# Altium project Vending machine.PrjPcb
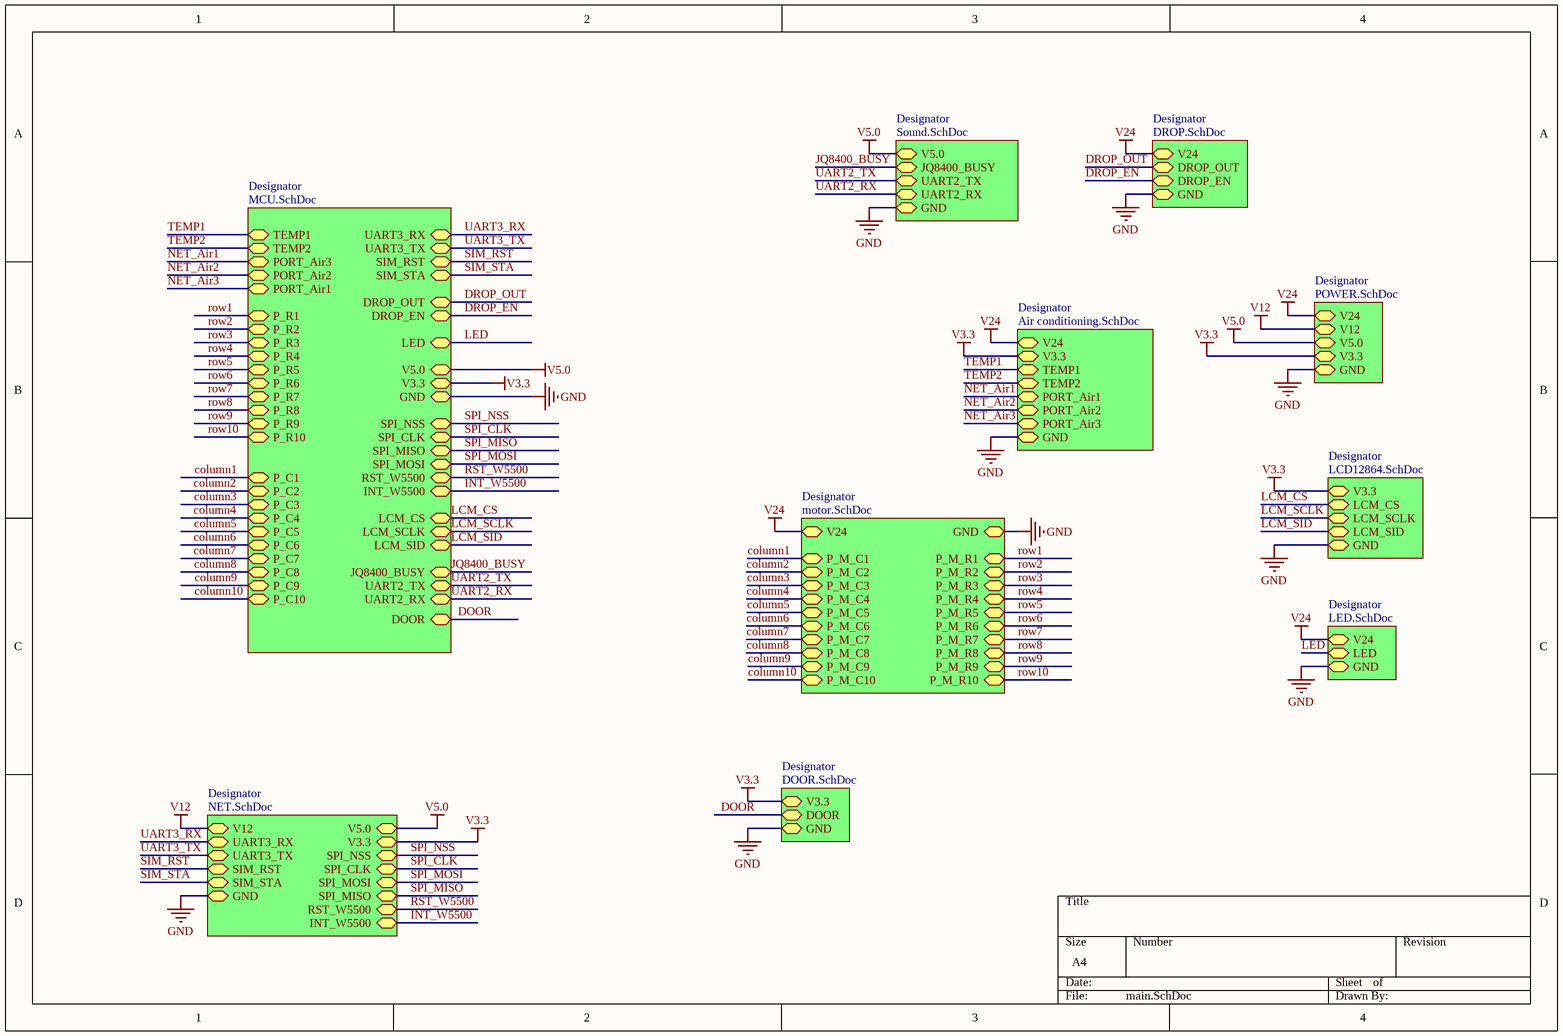
[diagram p0: main.SchDoc]
16 sheets, 316 parts. Net scope: hierarchical (ports join the sheet entries above them; power ports are global).
Board file: PCB.PcbDoc
Sheets:
  main.SchDoc
    Designator = NET.SchDoc
    Designator = motor.SchDoc
      C1 = PULL.SchDoc
      C2 = PULL.SchDoc
      C3 = PULL.SchDoc
      C4 = PULL.SchDoc
      C5 = PULL.SchDoc
      C6 = PULL.SchDoc
      C7 = PULL.SchDoc
      C8 = PULL.SchDoc
      C9 = PULL.SchDoc
      C10 = PULL.SchDoc
      R1 = PUSH.SchDoc
      R2 = PUSH.SchDoc
      R3 = PUSH.SchDoc
      R4 = PUSH.SchDoc
      R5 = PUSH.SchDoc
      R6 = PUSH.SchDoc
      R7 = PUSH.SchDoc
      R8 = PUSH.SchDoc
      R9 = PUSH.SchDoc
      R10 = PUSH.SchDoc
    Designator = Air conditioning.SchDoc
      C11 = PULL.SchDoc
      C12 = PULL.SchDoc
      C13 = PULL.SchDoc
    Designator = DROP.SchDoc
    Designator = LED.SchDoc
    Designator = MCU.SchDoc
      Designator = UART1.SchDoc
      Designator = M24C02.SchDoc
      Designator = RS485.SchDoc
    Designator = POWER.SchDoc
    Designator = Sound.SchDoc
    Designator = LCD12864.SchDoc
    Designator = DOOR.SchDoc

## Sheet main.SchDoc
size A4

### Sub-sheets
Designator = NET.SchDoc: UART3_RX, GND, UART3_TX, V12, SIM_RST, SIM_STA, V5.0, SPI_CLK, SPI_NSS, SPI_MOSI, RST_W5500, SPI_MISO, V3.3, INT_W5500
Designator = motor.SchDoc: V24, GND, P_M_R1, P_M_R3, P_M_R9, P_M_R5, P_M_R6, P_M_R8, P_M_R7, P_M_R10, P_M_R4, P_M_R2, P_M_C6, P_M_C1, P_M_C5, P_M_C9, P_M_C2, P_M_C4, P_M_C3, P_M_C7, P_M_C8, P_M_C10
Designator = Air conditioning.SchDoc: GND, V24, TEMP1, V3.3, TEMP2, PORT_Air2, PORT_Air1, PORT_Air3
Designator = DROP.SchDoc: DROP_EN, V24, GND, DROP_OUT
Designator = LED.SchDoc: LED, V24, GND
Designator = MCU.SchDoc: V5.0, GND, V3.3, TEMP1, TEMP2, DROP_EN, DROP_OUT, JQ8400_BUSY, UART2_RX, UART2_TX, SIM_RST, SIM_STA, UART3_RX, UART3_TX, LED, LCM_SID, LCM_SCLK, LCM_CS, SPI_NSS, SPI_MISO, RST_W5500, SPI_MOSI, INT_W5500, SPI_CLK, PORT_Air3, PORT_Air2, PORT_Air1, P_R4, P_R5, P_R6, P_R7, P_R8, P_R9, P_R10, P_R1, P_R2, P_R3, P_C1, P_C2, P_C3, P_C4, P_C5, P_C6, P_C7, P_C8, P_C9, P_C10, DOOR
Designator = POWER.SchDoc: V5.0, V3.3, GND, V24, V12
Designator = Sound.SchDoc: JQ8400_BUSY, UART2_TX, UART2_RX, GND, V5.0
Designator = LCD12864.SchDoc: LCM_CS, LCM_SCLK, GND, LCM_SID, V3.3
Designator = DOOR.SchDoc: V3.3, DOOR, GND

### Nets
GND: sheet Designator/GND, sheet Designator/GND, sheet Designator/GND, sheet Designator/GND, sheet Designator/GND, sheet Designator/GND, sheet Designator/GND, sheet Designator/GND, sheet Designator/GND, sheet Designator/GND
V3.3: sheet Designator/V3.3, sheet Designator/V3.3, sheet Designator/V3.3, sheet Designator/V3.3, sheet Designator/V3.3, sheet Designator/V3.3
V5.0: sheet Designator/V5.0, sheet Designator/V5.0, sheet Designator/V5.0, sheet Designator/V5.0
V12: sheet Designator/V12, sheet Designator/V12
V24: sheet Designator/V24, sheet Designator/V24, sheet Designator/V24, sheet Designator/V24, sheet Designator/V24
column1: sheet Designator/P_M_C1, sheet Designator/P_C1
column2: sheet Designator/P_M_C2, sheet Designator/P_C2
column3: sheet Designator/P_M_C3, sheet Designator/P_C3
column4: sheet Designator/P_M_C4, sheet Designator/P_C4
column5: sheet Designator/P_M_C5, sheet Designator/P_C5
column6: sheet Designator/P_M_C6, sheet Designator/P_C6
column7: sheet Designator/P_M_C7, sheet Designator/P_C7
column8: sheet Designator/P_M_C8, sheet Designator/P_C8
column9: sheet Designator/P_M_C9, sheet Designator/P_C9
column10: sheet Designator/P_M_C10, sheet Designator/P_C10
DOOR: sheet Designator/DOOR, sheet Designator/DOOR
DROP_EN: sheet Designator/DROP_EN, sheet Designator/DROP_EN
DROP_OUT: sheet Designator/DROP_OUT, sheet Designator/DROP_OUT
INT_W5500: sheet Designator/INT_W5500, sheet Designator/INT_W5500
JQ8400_BUSY: sheet Designator/JQ8400_BUSY, sheet Designator/JQ8400_BUSY
LCM_CS: sheet Designator/LCM_CS, sheet Designator/LCM_CS
LCM_SCLK: sheet Designator/LCM_SCLK, sheet Designator/LCM_SCLK
LCM_SID: sheet Designator/LCM_SID, sheet Designator/LCM_SID
LED: sheet Designator/LED, sheet Designator/LED
NET_Air1: sheet Designator/PORT_Air1, sheet Designator/PORT_Air3  [project net COLUMN11]
NET_Air2: sheet Designator/PORT_Air2, sheet Designator/PORT_Air2  [project net COLUMN12]
NET_Air3: sheet Designator/PORT_Air3, sheet Designator/PORT_Air1  [project net COLUMN13]
row1: sheet Designator/P_M_R1, sheet Designator/P_R1  [project net N_R1]
row2: sheet Designator/P_M_R2, sheet Designator/P_R2  [project net N_R2]
row3: sheet Designator/P_M_R3, sheet Designator/P_R3  [project net N_R3]
row4: sheet Designator/P_M_R4, sheet Designator/P_R4  [project net N_R4]
row5: sheet Designator/P_M_R5, sheet Designator/P_R5  [project net N_R5]
row6: sheet Designator/P_M_R6, sheet Designator/P_R6  [project net N_R6]
row7: sheet Designator/P_M_R7, sheet Designator/P_R7  [project net N_R7]
row8: sheet Designator/P_M_R8, sheet Designator/P_R8  [project net N_R8]
row9: sheet Designator/P_M_R9, sheet Designator/P_R9  [project net N_R9]
row10: sheet Designator/P_M_R10, sheet Designator/P_R10  [project net N_R10]
RST_W5500: sheet Designator/RST_W5500, sheet Designator/RST_W5500
SIM_RST: sheet Designator/SIM_RST, sheet Designator/SIM_RST
SIM_STA: sheet Designator/SIM_STA, sheet Designator/SIM_STA
SPI_CLK: sheet Designator/SPI_CLK, sheet Designator/SPI_CLK  [project net SPI1_CLK]
SPI_MISO: sheet Designator/SPI_MISO, sheet Designator/SPI_MISO  [project net SPI1_MISO]
SPI_MOSI: sheet Designator/SPI_MOSI, sheet Designator/SPI_MOSI  [project net SPI1_MOSI]
SPI_NSS: sheet Designator/SPI_NSS, sheet Designator/SPI_NSS  [project net CS_W5500]
TEMP1: sheet Designator/TEMP1, sheet Designator/TEMP1
TEMP2: sheet Designator/TEMP2, sheet Designator/TEMP2
UART2_RX: sheet Designator/UART2_RX, sheet Designator/UART2_RX
UART2_TX: sheet Designator/UART2_TX, sheet Designator/UART2_TX
UART3_RX: sheet Designator/UART3_RX, sheet Designator/UART3_RX
UART3_TX: sheet Designator/UART3_TX, sheet Designator/UART3_TX

## Sheet NET.SchDoc
size A4
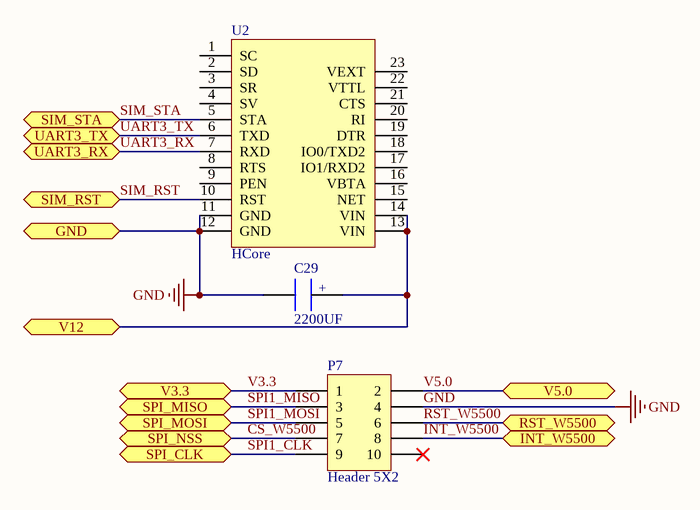
[diagram p1: NET.SchDoc]

### Parts
C29  2200UF  [8X12_CAP]
P7  Header 5X2  [HDR2X5]
U2  HCore  [HCore]

### Ports
GND, INT_W5500, RST_W5500, SIM_RST, SIM_STA, SPI_CLK, SPI_MISO, SPI_MOSI, SPI_NSS, UART3_RX, UART3_TX, V3.3, V5.0, V12

### Nets
GND: C29.2 P7.4 U2.11(GND) U2.12(GND) ; port GND
V3.3: P7.1 ; port V3.3
V5.0: P7.2 ; port V5.0
V12: C29.1 U2.13(VIN) U2.14(VIN) ; port V12
CS_W5500: P7.7 ; port SPI_NSS
INT_W5500: P7.8 ; port INT_W5500
RST_W5500: P7.6 ; port RST_W5500
SIM_RST: U2.10(RST) ; port SIM_RST
SIM_STA: U2.5(STA) ; port SIM_STA
SPI1_CLK: P7.9 ; port SPI_CLK
SPI1_MISO: P7.3 ; port SPI_MISO
SPI1_MOSI: P7.5 ; port SPI_MOSI
UART3_RX: U2.7(RXD) ; port UART3_RX
UART3_TX: U2.6(TXD) ; port UART3_TX

Not connected (* = marked no-connect by the designer): P7 10*; U2 1(SC) 2(SD) 3(SR) 4(SV) 8(RTS) 9(PEN) 15(NET) 16(VBTA) 17(IO1/RXD2) 18(IO0/TXD2) 19(DTR) 20(RI) 21(CTS) 22(VTTL) 23(VEXT)

### Notes on the sheet
- (in symbol CAP) +

### Library data of the parts
C29 = CAP
P7 = Header 5X2: Header, 5-Pin, Dual row; LatestRevisionDate: 17-Jul-2002; LatestRevisionNote: Re-released for DXP Platform.; Publisher: Altium Limited

## Sheet motor.SchDoc
size A4
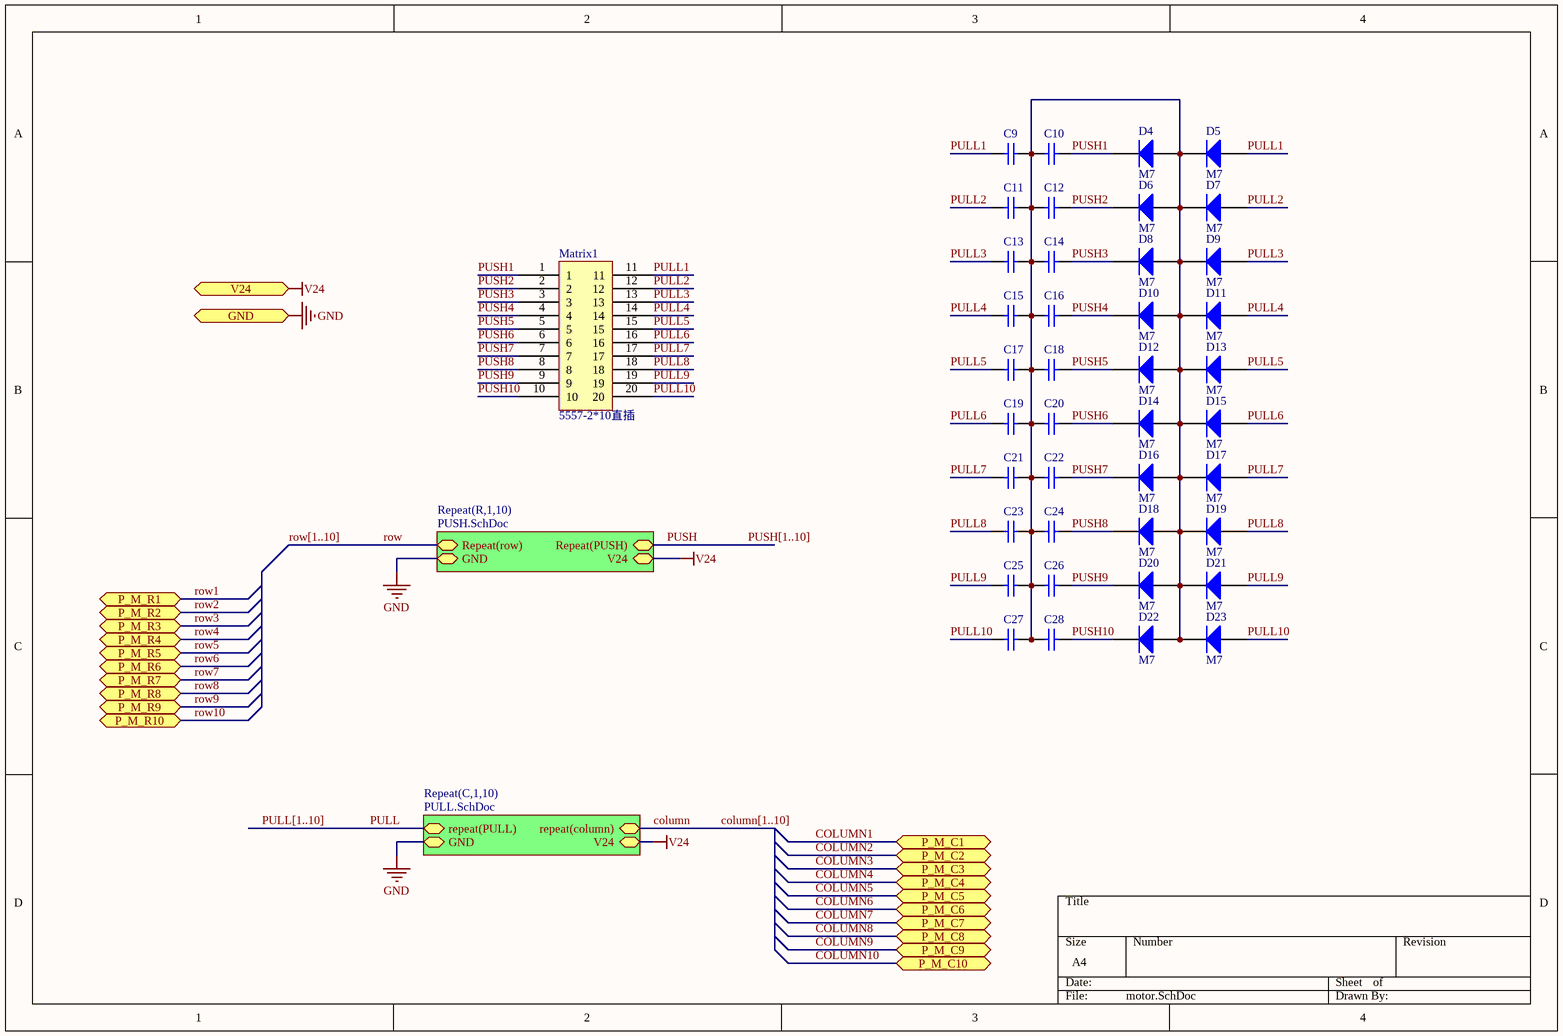
[diagram p2: motor.SchDoc]

### Parts
C9  100nF(104) 10% 50V  [0805_C]  (value not drawn)
C10  100nF(104) 10% 50V  [0805_C]  (value not drawn)
C11  100nF(104) 10% 50V  [0805_C]  (value not drawn)
C12  100nF(104) 10% 50V  [0805_C]  (value not drawn)
C13  100nF(104) 10% 50V  [0805_C]  (value not drawn)
C14  100nF(104) 10% 50V  [0805_C]  (value not drawn)
C15  100nF(104) 10% 50V  [0805_C]  (value not drawn)
C16  100nF(104) 10% 50V  [0805_C]  (value not drawn)
C17  100nF(104) 10% 50V  [0805_C]  (value not drawn)
C18  100nF(104) 10% 50V  [0805_C]  (value not drawn)
C19  100nF(104) 10% 50V  [0805_C]  (value not drawn)
C20  100nF(104) 10% 50V  [0805_C]  (value not drawn)
C21  100nF(104) 10% 50V  [0805_C]  (value not drawn)
C22  100nF(104) 10% 50V  [0805_C]  (value not drawn)
C23  100nF(104) 10% 50V  [0805_C]  (value not drawn)
C24  100nF(104) 10% 50V  [0805_C]  (value not drawn)
C25  100nF(104) 10% 50V  [0805_C]  (value not drawn)
C26  100nF(104) 10% 50V  [0805_C]  (value not drawn)
C27  100nF(104) 10% 50V  [0805_C]  (value not drawn)
C28  100nF(104) 10% 50V  [0805_C]  (value not drawn)
D4  M7  [SMA(DO-214AC)_S1]
D5  M7  [SMA(DO-214AC)_S1]
D6  M7  [SMA(DO-214AC)_S1]
D7  M7  [SMA(DO-214AC)_S1]
D8  M7  [SMA(DO-214AC)_S1]
D9  M7  [SMA(DO-214AC)_S1]
D10  M7  [SMA(DO-214AC)_S1]
D11  M7  [SMA(DO-214AC)_S1]
D12  M7  [SMA(DO-214AC)_S1]
D13  M7  [SMA(DO-214AC)_S1]
D14  M7  [SMA(DO-214AC)_S1]
D15  M7  [SMA(DO-214AC)_S1]
D16  M7  [SMA(DO-214AC)_S1]
D17  M7  [SMA(DO-214AC)_S1]
D18  M7  [SMA(DO-214AC)_S1]
D19  M7  [SMA(DO-214AC)_S1]
D20  M7  [SMA(DO-214AC)_S1]
D21  M7  [SMA(DO-214AC)_S1]
D22  M7  [SMA(DO-214AC)_S1]
D23  M7  [SMA(DO-214AC)_S1]
Matrix1  5557-2*10直插  [5557_2*10]

### Sub-sheets
Repeat(C,1,10) = PULL.SchDoc: repeat(PULL), GND, repeat(column), V24
Repeat(R,1,10) = PUSH.SchDoc: Repeat(PUSH), V24, Repeat(row), GND

### Ports
GND, P_M_C1, P_M_C2, P_M_C3, P_M_C4, P_M_C5, P_M_C6, P_M_C7, P_M_C8, P_M_C9, P_M_C10, P_M_R1, P_M_R2, P_M_R3, P_M_R4, P_M_R5, P_M_R6, P_M_R7, P_M_R8, P_M_R9, P_M_R10, V24

### Nets
GND: port GND, sheet Repeat(C,1,10)/GND, sheet Repeat(R,1,10)/GND
V24: port V24, sheet Repeat(C,1,10)/V24, sheet Repeat(R,1,10)/V24
column: sheet Repeat(C,1,10)/repeat(column)
PULL: sheet Repeat(C,1,10)/repeat(PULL)
PULL1: C9.1 D5.1(A) Matrix1.11
PULL2: C11.1 D7.1(A) Matrix1.12
PULL3: C13.1 D9.1(A) Matrix1.13
PULL4: C15.1 D11.1(A) Matrix1.14
PULL5: C17.1 D13.1(A) Matrix1.15
PULL6: C19.1 D15.1(A) Matrix1.16
PULL7: C21.1 D17.1(A) Matrix1.17
PULL8: C23.1 D19.1(A) Matrix1.18
PULL9: C25.1 D21.1(A) Matrix1.19
PULL10: C27.1 D23.1(A) Matrix1.20
PUSH: sheet Repeat(R,1,10)/Repeat(PUSH)
PUSH1: C10.2 D4.2(K) Matrix1.1
PUSH2: C12.2 D6.2(K) Matrix1.2
PUSH3: C14.2 D8.2(K) Matrix1.3
PUSH4: C16.2 D10.2(K) Matrix1.4
PUSH5: C18.2 D12.2(K) Matrix1.5
PUSH6: C20.2 D14.2(K) Matrix1.6
PUSH7: C22.2 D16.2(K) Matrix1.7
PUSH8: C24.2 D18.2(K) Matrix1.8
PUSH9: C26.2 D20.2(K) Matrix1.9
PUSH10: C28.2 D22.2(K) Matrix1.10
row: sheet Repeat(R,1,10)/Repeat(row)
NetC9_2: C9.2 C10.1 C11.2 C12.1 C13.2 C14.1 C15.2 C16.1 C17.2 C18.1 C19.2 C20.1 C21.2 C22.1 C23.2 C24.1 C25.2 C26.1 C27.2 C28.1 D4.1(A) D5.2(K) D6.1(A) D7.2(K) D8.1(A) D9.2(K) D10.1(A) D11.2(K) D12.1(A) D13.2(K) D14.1(A) D15.2(K) D16.1(A) D17.2(K) D18.1(A) D19.2(K) D20.1(A) D21.2(K) D22.1(A) D23.2(K)

### Buses and harness runs
bus column[1..10]
bus PULL[1..10]
bus PUSH[1..10]
bus row[1..10]

### Library data of the parts
C9-C28 = 0805 100nF(104) 10% 50V: 贴片电容; ComponentLink1Description: 供应商链接; ComponentLink1URL: http://www.szlcsc.com/product/details_50686.html; Package: 0805; Supplier: LC; SuppliersPartNumber: C49678
D4-D23 = SMA(DO-214AC) M7: 二极管; 备注: 1N4007 4007 编号C2464 已经停售, 使用新物料编号C95872; ComponentLink1Description: 供应商链接; ComponentLink1URL: http://www.szlcsc.com/product/details_2841.html; Package: SMA(DO-214AC); Supplier: LC; SuppliersPartNumber: C95872

## Sheet PULL.SchDoc
size A4
Used 13 times, as channels Designator/C1, Designator/C2, Designator/C3, Designator/C4, Designator/C5, Designator/C6, Designator/C7, Designator/C8, Designator/C9, Designator/C10, Designator/C11, Designator/C12, Designator/C13. Parts and nets are listed once, with the designators drawn on the sheet.
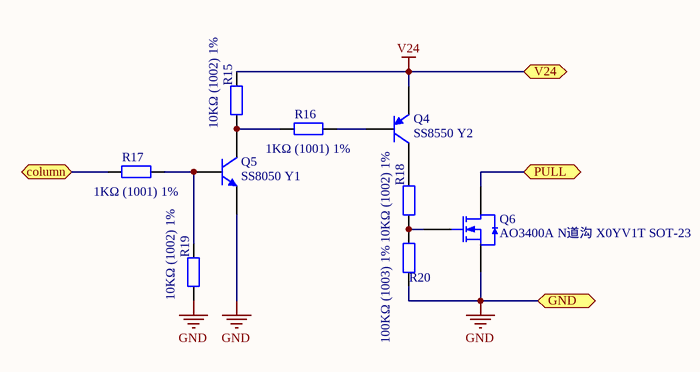
[diagram p3: PULL.SchDoc]

### Parts
Q4  SS8550 Y2  [SOT-23(SOT-23-3)]
Q5  SS8050 Y1  [SOT-23(SOT-23-3)]
Q6  AO3400A N道沟 X0YV1T SOT-23  [SOT-23-3L]
R15  10KΩ (1002) 1%  [0805_R]
R16  1KΩ (1001) 1%  [0805_R]
R17  1KΩ (1001) 1%  [0805_R]
R18  10KΩ (1002) 1%  [0805_R]
R19  10KΩ (1002) 1%  [0805_R]
R20  100KΩ (1003) 1%  [0805_R]

### Ports
column, GND, PULL, V24

### Nets
GND: Q5.2(E) Q6.2(S) R19.1 R20.2 ; port GND
V24: Q4.2(E) R15.2 ; port V24
column: R17.2 ; port column
PULL: Q6.3(D) ; port PULL
NetQ4_1: Q4.1(B) R16.1
NetQ4_3: Q4.3(C) R18.2
NetQ5_1: Q5.1(B) R17.1 R19.2
NetQ5_3: Q5.3(C) R15.1 R16.2
NetQ6_1: Q6.1(G) R18.1 R20.1

### Channels
Designator/C1: designators end in _C1; ports column=column1 GND=GND PULL=PULL1 V24=V24
Designator/C2: designators end in _C2; ports column=column2 GND=GND PULL=PULL2 V24=V24
Designator/C3: designators end in _C3; ports column=column3 GND=GND PULL=PULL3 V24=V24
Designator/C4: designators end in _C4; ports column=column4 GND=GND PULL=PULL4 V24=V24
Designator/C5: designators end in _C5; ports column=column5 GND=GND PULL=PULL5 V24=V24
Designator/C6: designators end in _C6; ports column=column6 GND=GND PULL=PULL6 V24=V24
Designator/C7: designators end in _C7; ports column=column7 GND=GND PULL=PULL7 V24=V24
Designator/C8: designators end in _C8; ports column=column8 GND=GND PULL=PULL8 V24=V24
Designator/C9: designators end in _C9; ports column=column9 GND=GND PULL=PULL9 V24=V24
Designator/C10: designators end in _C10; ports column=column10 GND=GND PULL=PULL10 V24=V24
Designator/C11: designators end in _C11; ports column=COLUMN11 GND=GND PULL=PULL11 V24=V24
Designator/C12: designators end in _C12; ports column=COLUMN12 GND=GND PULL=PULL12 V24=V24
Designator/C13: designators end in _C13; ports column=COLUMN13 GND=GND PULL=PULL13 V24=V24

### Library data of the parts
Q4 = SOT-23 SS8550 Y2: 三极管; ComponentLink1Description: 供应商链接; ComponentLink1URL: http://www.szlcsc.com/product/details_9037.html; Package: SOT-23; Supplier: LC; SuppliersPartNumber: C8542
Q5 = SOT-23 SS8050 Y1: 三极管; ComponentLink1Description: 供应商链接; ComponentLink1URL: http://www.szlcsc.com/product/details_2507.html; Package: SOT-23; Supplier: LC; SuppliersPartNumber: C2150
Q6 = AO3400A N道沟 X0YV1T SOT-23: MOS(场效应管); ComponentLink1Description: 供应商链接; ComponentLink1URL: http://www.szlcsc.com/product/details_21629.html; Package: SOT-23; Supplier: LC; SuppliersPartNumber: C20917
R15 R18 R19 = 0805 10KΩ (1002) 1%: 贴片电阻; ComponentLink1Description: 供应商链接; ComponentLink1URL: http://www.szlcsc.com/product/details_18102.html; Package: 0805; Supplier: LC; SuppliersPartNumber: C17414
R16 R17 = 0805 1KΩ (1001) 1%: 贴片电阻; ComponentLink1Description: 供应商链接; ComponentLink1URL: http://www.szlcsc.com/product/details_18201.html; Package: 0805; Supplier: LC; SuppliersPartNumber: C17513
R20 = 0805 100KΩ (1003) 1%: 贴片电阻; ComponentLink1Description: 供应商链接; ComponentLink1URL: http://www.szlcsc.com/product/details_18095.html; Package: 0805; Supplier: LC; SuppliersPartNumber: C17407

## Sheet PUSH.SchDoc
size A4
Used 10 times, as channels Designator/R1, Designator/R2, Designator/R3, Designator/R4, Designator/R5, Designator/R6, Designator/R7, Designator/R8, Designator/R9, Designator/R10. Parts and nets are listed once, with the designators drawn on the sheet.
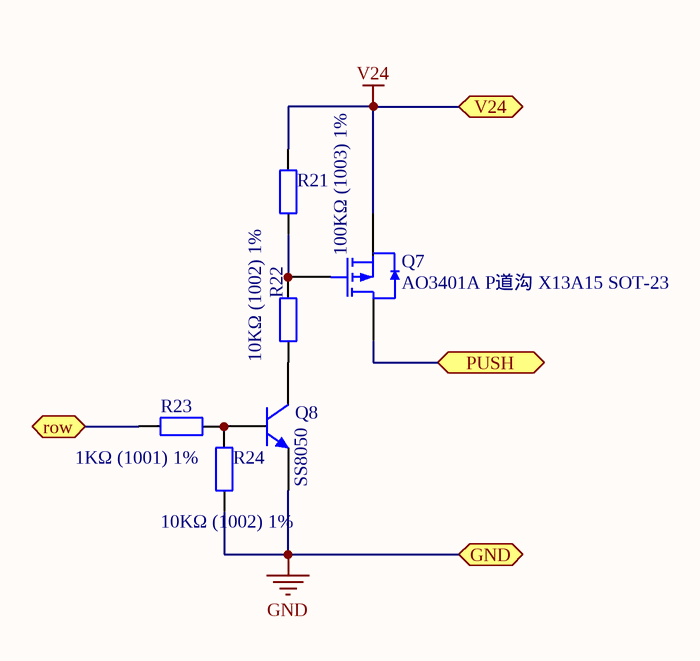
[diagram p4: PUSH.SchDoc]

### Parts
Q7  AO3401A P道沟 X13A15 SOT-23  [SOT-23-3L]
Q8  SS8050  [SOT-23(SOT-23-3)]
R21  100KΩ (1003) 1%  [0805_R]
R22  10KΩ (1002) 1%  [0805_R]
R23  1KΩ (1001) 1%  [0805_R]
R24  10KΩ (1002) 1%  [0805_R]

### Ports
GND, PUSH, row, V24

### Nets
GND: Q8.2(E) R24.2 ; port GND
V24: Q7.2(S) R21.1 ; port V24
PUSH: Q7.3(D) ; port PUSH
row: R23.2 ; port row
NetQ7_1: Q7.1(G) R21.2 R22.2
NetQ8_1: Q8.1(B) R23.1 R24.1
NetQ8_3: Q8.3(C) R22.1

### Channels
Designator/R1: designators end in _R1; ports GND=GND PUSH=PUSH1 row=N_R1 V24=V24
Designator/R2: designators end in _R2; ports GND=GND PUSH=PUSH2 row=N_R2 V24=V24
Designator/R3: designators end in _R3; ports GND=GND PUSH=PUSH3 row=N_R3 V24=V24
Designator/R4: designators end in _R4; ports GND=GND PUSH=PUSH4 row=N_R4 V24=V24
Designator/R5: designators end in _R5; ports GND=GND PUSH=PUSH5 row=N_R5 V24=V24
Designator/R6: designators end in _R6; ports GND=GND PUSH=PUSH6 row=N_R6 V24=V24
Designator/R7: designators end in _R7; ports GND=GND PUSH=PUSH7 row=N_R7 V24=V24
Designator/R8: designators end in _R8; ports GND=GND PUSH=PUSH8 row=N_R8 V24=V24
Designator/R9: designators end in _R9; ports GND=GND PUSH=PUSH9 row=N_R9 V24=V24
Designator/R10: designators end in _R10; ports GND=GND PUSH=PUSH10 row=N_R10 V24=V24

### Library data of the parts
Q7 = AO3401A P道沟 X13A15 SOT-23: MOS(场效应管); ComponentLink1Description: 供应商链接; ComponentLink1URL: http://www.szlcsc.com/product/details_15801.html; Package: SOT-23; Supplier: LC; SuppliersPartNumber: C15127
Q8 = SOT-23 SS8050 Y1: 三极管; ComponentLink1Description: 供应商链接; ComponentLink1URL: http://www.szlcsc.com/product/details_2507.html; Package: SOT-23; Supplier: LC; SuppliersPartNumber: C2150
R21 = 0805 100KΩ (1003) 1%: 贴片电阻; ComponentLink1Description: 供应商链接; ComponentLink1URL: http://www.szlcsc.com/product/details_18095.html; Package: 0805; Supplier: LC; SuppliersPartNumber: C17407
R22 R24 = 0805 10KΩ (1002) 1%: 贴片电阻; ComponentLink1Description: 供应商链接; ComponentLink1URL: http://www.szlcsc.com/product/details_18102.html; Package: 0805; Supplier: LC; SuppliersPartNumber: C17414
R23 = 0805 1KΩ (1001) 1%: 贴片电阻; ComponentLink1Description: 供应商链接; ComponentLink1URL: http://www.szlcsc.com/product/details_18201.html; Package: 0805; Supplier: LC; SuppliersPartNumber: C17513

## Sheet Air conditioning.SchDoc
size A4
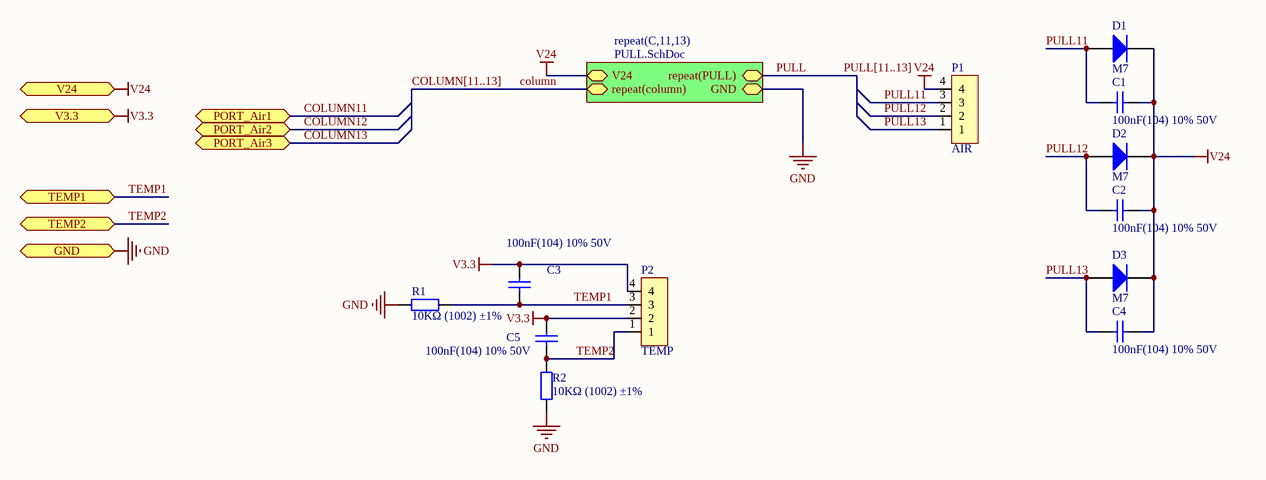
[diagram p5: Air conditioning.SchDoc]

### Parts
C1  100nF(104) 10% 50V  [0805_C]
C2  100nF(104) 10% 50V  [0805_C]
C3  100nF(104) 10% 50V  [0805_C]
C4  100nF(104) 10% 50V  [0805_C]
C5  100nF(104) 10% 50V  [0805_C]
D1  M7  [SMA(DO-214AC)_S1]
D2  M7  [SMA(DO-214AC)_S1]
D3  M7  [SMA(DO-214AC)_S1]
P1  AIR  [4P_XH2.54]
P2  TEMP  [4P_XH2.54]
R1  10KΩ (1002) ±1%  [0805_R]
R2  10KΩ (1002) ±1%  [0805_R]

### Sub-sheets
repeat(C,11,13) = PULL.SchDoc: GND, repeat(PULL), V24, repeat(column)

### Ports
GND, PORT_Air1, PORT_Air2, PORT_Air3, TEMP1, TEMP2, V3.3, V24

### Nets
GND: R1.2 R2.2 ; port GND, sheet repeat(C,11,13)/GND
V3.3: C3.1 C5.1 P2.2 P2.4 ; port V3.3
V24: C1.2 C2.2 C4.2 D1.2(K) D2.2(K) D3.2(K) P1.4 ; port V24, sheet repeat(C,11,13)/V24
column: sheet repeat(C,11,13)/repeat(column)
PULL: sheet repeat(C,11,13)/repeat(PULL)
PULL11: C1.1 D1.1(A) P1.3
PULL12: C2.1 D2.1(A) P1.2
PULL13: C4.1 D3.1(A) P1.1
TEMP1: C3.2 P2.3 R1.1 ; port TEMP1
TEMP2: C5.2 P2.1 R2.1 ; port TEMP2

### Buses and harness runs
bus COLUMN[11..13]
bus PULL[11..13]

### Library data of the parts
C1-C5 = 0805 100nF(104) 10% 50V: 贴片电容; ComponentLink1Description: 供应商链接; ComponentLink1URL: http://www.szlcsc.com/product/details_50686.html; Package: 0805; Supplier: LC; SuppliersPartNumber: C49678
D1-D3 = SMA(DO-214AC) M7: as D4 on sheet motor; ComponentLink1Description: 供应商链接; ComponentLink1URL: http://www.szlcsc.com/product/details_2841.html; Package: SMA(DO-214AC); Supplier: LC; SuppliersPartNumber: C95872
P1 P2 = 4P_XH2.54
R1 R2 = 0805 10KΩ (1002) 1%: 贴片电阻; ComponentLink1Description: 供应商链接; ComponentLink1URL: http://www.szlcsc.com/product/details_18102.html; Package: 0805; Supplier: LC; SuppliersPartNumber: C17414

## Sheet DROP.SchDoc
size A4
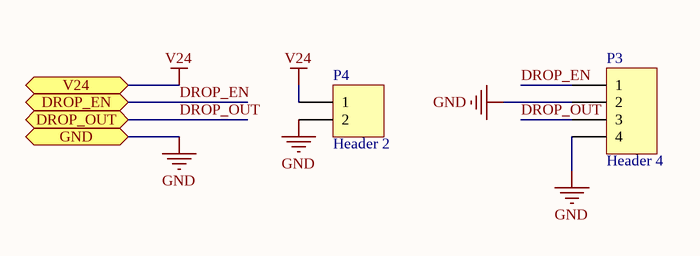
[diagram p6: DROP.SchDoc]

### Parts
P3  Header 4  [4P_XH2.54]
P4  Header 2  [2P_XH2.54]

### Ports
DROP_EN, DROP_OUT, GND, V24

### Nets
GND: P3.2 P3.4 P4.2 ; port GND
V24: P4.1 ; port V24
DROP_EN: P3.1 ; port DROP_EN
DROP_OUT: P3.3 ; port DROP_OUT

### Library data of the parts
P3 = Header 4: Header, 4-Pin; LatestRevisionDate: 17-Jul-2002; LatestRevisionNote: Re-released for DXP Platform.; Publisher: Altium Limited
P4 = Header 2: Header, 2-Pin; LatestRevisionDate: 17-Jul-2002; LatestRevisionNote: Re-released for DXP Platform.; Publisher: Altium Limited

## Sheet LED.SchDoc
size A4
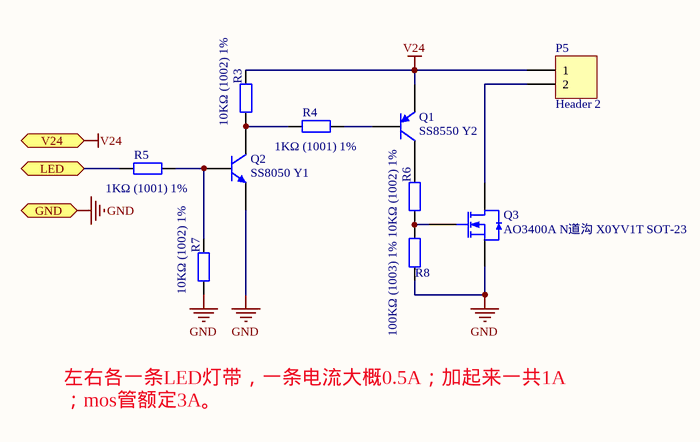
[diagram p7: LED.SchDoc]

### Parts
P5  Header 2  [2P_XH2.54]
Q1  SS8550 Y2  [SOT-23(SOT-23-3)]
Q2  SS8050 Y1  [SOT-23(SOT-23-3)]
Q3  AO3400A N道沟 X0YV1T SOT-23  [SOT-23-3L]
R3  10KΩ (1002) 1%  [0805_R]
R4  1KΩ (1001) 1%  [0805_R]
R5  1KΩ (1001) 1%  [0805_R]
R6  10KΩ (1002) 1%  [0805_R]
R7  10KΩ (1002) 1%  [0805_R]
R8  100KΩ (1003) 1%  [0805_R]

### Ports
GND, LED, V24

### Nets
GND: Q2.2(E) Q3.2(S) R7.1 R8.2 ; port GND
V24: P5.1 Q1.2(E) R3.2 ; port V24
LED: R5.2 ; port LED
NetP5_2: P5.2 Q3.3(D)
NetQ1_1: Q1.1(B) R4.1
NetQ1_3: Q1.3(C) R6.2
NetQ2_1: Q2.1(B) R5.1 R7.2
NetQ2_3: Q2.3(C) R3.1 R4.2
NetQ3_1: Q3.1(G) R6.1 R8.1

### Notes on the sheet
- 左右各一条LED灯带，一条电流大概0.5A；加起来一共1A；mos管额定3A。

### Library data of the parts
P5 = Header 2: Header, 2-Pin; LatestRevisionDate: 17-Jul-2002; LatestRevisionNote: Re-released for DXP Platform.; Publisher: Altium Limited
Q1 = SOT-23 SS8550 Y2: 三极管; ComponentLink1Description: 供应商链接; ComponentLink1URL: http://www.szlcsc.com/product/details_9037.html; Package: SOT-23; Supplier: LC; SuppliersPartNumber: C8542
Q2 = SOT-23 SS8050 Y1: 三极管; ComponentLink1Description: 供应商链接; ComponentLink1URL: http://www.szlcsc.com/product/details_2507.html; Package: SOT-23; Supplier: LC; SuppliersPartNumber: C2150
Q3 = AO3400A N道沟 X0YV1T SOT-23: MOS(场效应管); ComponentLink1Description: 供应商链接; ComponentLink1URL: http://www.szlcsc.com/product/details_21629.html; Package: SOT-23; Supplier: LC; SuppliersPartNumber: C20917
R3 R6 R7 = 0805 10KΩ (1002) 1%: 贴片电阻; ComponentLink1Description: 供应商链接; ComponentLink1URL: http://www.szlcsc.com/product/details_18102.html; Package: 0805; Supplier: LC; SuppliersPartNumber: C17414
R4 R5 = 0805 1KΩ (1001) 1%: 贴片电阻; ComponentLink1Description: 供应商链接; ComponentLink1URL: http://www.szlcsc.com/product/details_18201.html; Package: 0805; Supplier: LC; SuppliersPartNumber: C17513
R8 = 0805 100KΩ (1003) 1%: 贴片电阻; ComponentLink1Description: 供应商链接; ComponentLink1URL: http://www.szlcsc.com/product/details_18095.html; Package: 0805; Supplier: LC; SuppliersPartNumber: C17407

## Sheet MCU.SchDoc
size A4 portrait
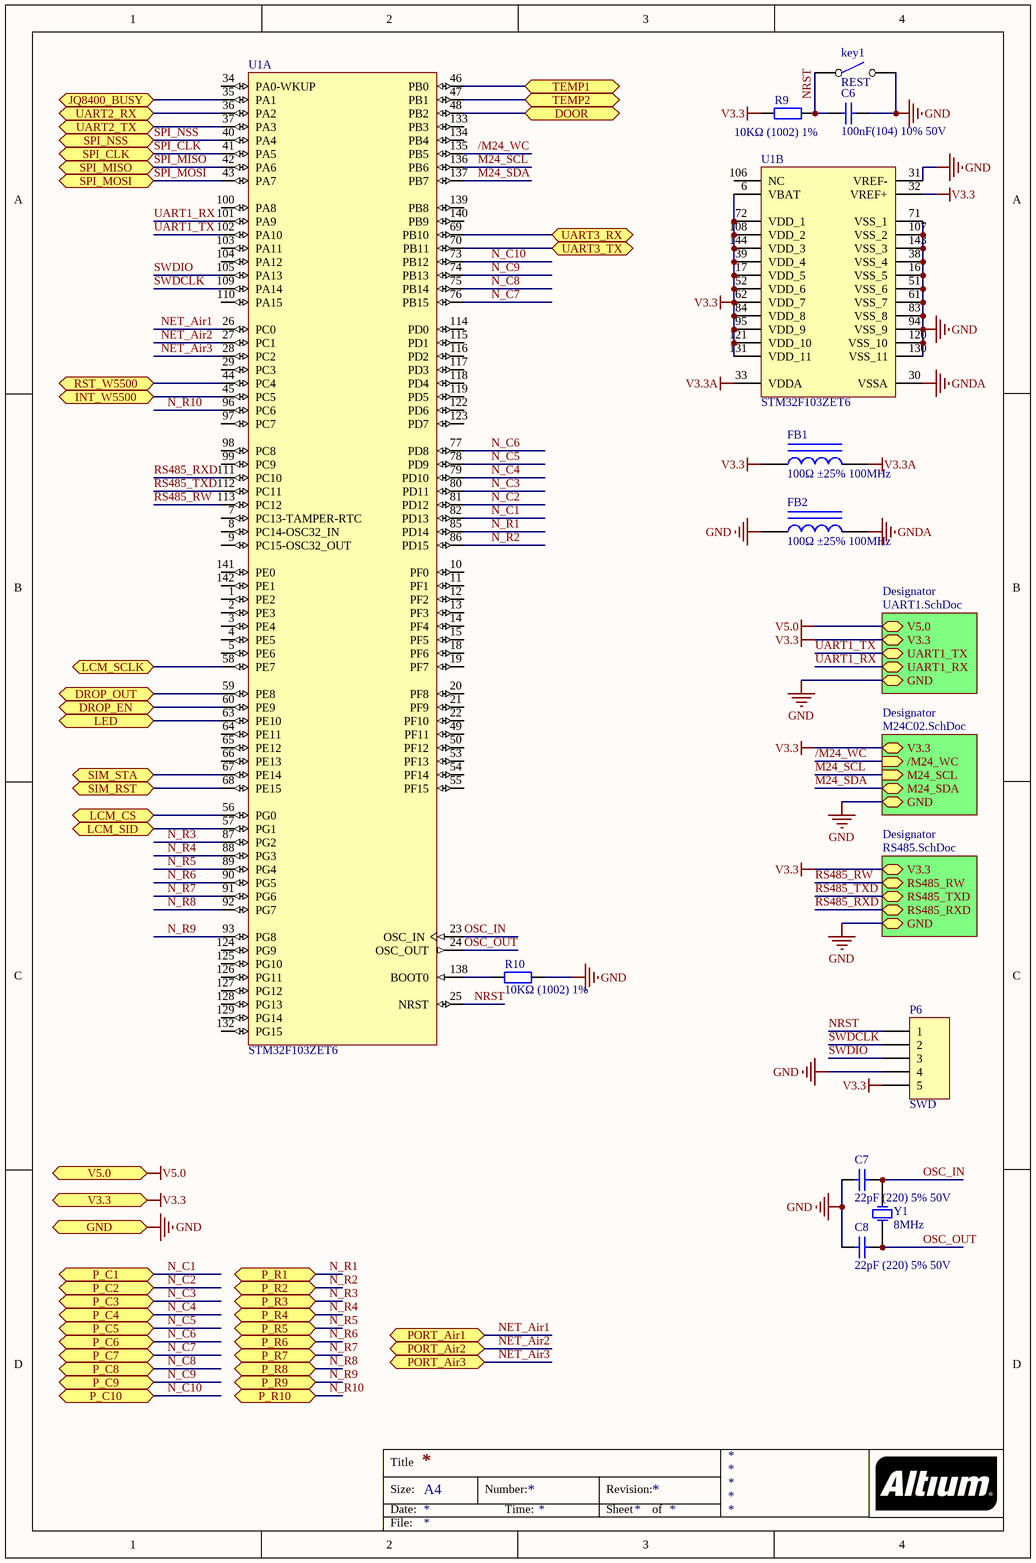
[diagram p8: MCU.SchDoc]

### Parts
C6  100nF(104) 10% 50V  [0805_C]
C7  22pF (220) 5% 50V  [0805_C]
C8  22pF (220) 5% 50V  [0805_C]
FB1  100Ω ±25% 100MHz  [0805_L]
FB2  100Ω ±25% 100MHz  [0805_L]
key1  REST  [key]
P6  SWD  [HDR1X5]
R9  10KΩ (1002) 1%  [0805_R]
R10  10KΩ (1002) 1%  [0805_R]
U1  STM32F103ZET6  [LQFP-144_20x20x05P]  (parts A,B of 2)
Y1  8MHz  [SMD-5032_2P]

### Sub-sheets
Designator = UART1.SchDoc: V5.0, GND, V3.3, UART1_TX, UART1_RX
Designator = M24C02.SchDoc: V3.3, GND, M24_SDA, /M24_WC (in), M24_SCL (in)
Designator = RS485.SchDoc: GND, V3.3, RS485_RW, RS485_TXD, RS485_RXD

### Ports
DOOR, DROP_EN, DROP_OUT, GND, INT_W5500, JQ8400_BUSY, LCM_CS, LCM_SCLK, LCM_SID, LED, P_C1, P_C2, P_C3, P_C4, P_C5, P_C6, P_C7, P_C8, P_C9, P_C10, P_R1, P_R2, P_R3, P_R4, P_R5, P_R6, P_R7, P_R8, P_R9, P_R10, PORT_Air1, PORT_Air2, PORT_Air3, RST_W5500, SIM_RST, SIM_STA, SPI_CLK, SPI_MISO, SPI_MOSI, SPI_NSS, TEMP1, TEMP2, UART2_RX, UART2_TX, UART3_RX, UART3_TX, V3.3, V5.0

### Nets
GND: C6.2 C7.2 C8.2 FB2.1 key1.2 P6.4 R10.2 U1.16(VSS_5) U1.31(VREF-) U1.38(VSS_4) U1.51(VSS_6) U1.61(VSS_7) U1.71(VSS_1) U1.83(VSS_8) U1.94(VSS_9) U1.107(VSS_2) U1.120(VSS_10) U1.130(VSS_11) U1.143(VSS_3) ; port GND, sheet Designator/GND, sheet Designator/GND, sheet Designator/GND
GNDA: FB2.2 U1.30(VSSA)
V3.3: FB1.1 P6.5 R9.2 U1.6(VBAT) U1.17(VDD_5) U1.32(VREF+) U1.39(VDD_4) U1.52(VDD_6) U1.62(VDD_7) U1.72(VDD_1) U1.84(VDD_8) U1.95(VDD_9) U1.108(VDD_2) U1.121(VDD_10) U1.131(VDD_11) U1.144(VDD_3) ; port V3.3, sheet Designator/V3.3, sheet Designator/V3.3, sheet Designator/V3.3
V3.3A: FB1.2 U1.33(VDDA)
V5.0: port V5.0, sheet Designator/V5.0
/M24_WC: U1.135(PB5) ; sheet Designator//M24_WC
DOOR: U1.48(PB2) ; port DOOR
DROP_EN: U1.60(PE9) ; port DROP_EN
DROP_OUT: U1.59(PE8) ; port DROP_OUT
INT_W5500: U1.45(PC5) ; port INT_W5500
JQ8400_BUSY: U1.35(PA1) ; port JQ8400_BUSY
LCM_CS: U1.56(PG0) ; port LCM_CS
LCM_SCLK: U1.58(PE7) ; port LCM_SCLK
LCM_SID: U1.57(PG1) ; port LCM_SID
LED: U1.63(PE10) ; port LED
M24_SCL: U1.136(PB6) ; sheet Designator/M24_SCL
M24_SDA: U1.137(PB7) ; sheet Designator/M24_SDA
N_C1: U1.82(PD13) ; port P_C1  [project net column1]
N_C2: U1.81(PD12) ; port P_C2  [project net column2]
N_C3: U1.80(PD11) ; port P_C3  [project net column3]
N_C4: U1.79(PD10) ; port P_C4  [project net column4]
N_C5: U1.78(PD9) ; port P_C5  [project net column5]
N_C6: U1.77(PD8) ; port P_C6  [project net column6]
N_C7: U1.76(PB15) ; port P_C7  [project net column7]
N_C8: U1.75(PB14) ; port P_C8  [project net column8]
N_C9: U1.74(PB13) ; port P_C9  [project net column9]
N_C10: U1.73(PB12) ; port P_C10  [project net column10]
N_R1: U1.85(PD14) ; port P_R1
N_R2: U1.86(PD15) ; port P_R2
N_R3: U1.87(PG2) ; port P_R3
N_R4: U1.88(PG3) ; port P_R4
N_R5: U1.89(PG4) ; port P_R5
N_R6: U1.90(PG5) ; port P_R6
N_R7: U1.91(PG6) ; port P_R7
N_R8: U1.92(PG7) ; port P_R8
N_R9: U1.93(PG8) ; port P_R9
N_R10: U1.96(PC6) ; port P_R10
NET_Air1: U1.26(PC0) ; port PORT_Air1  [project net COLUMN13]
NET_Air2: U1.27(PC1) ; port PORT_Air2  [project net COLUMN12]
NET_Air3: U1.28(PC2) ; port PORT_Air3  [project net COLUMN11]
NRST: C6.1 key1.1 P6.1 R9.1 U1.25(NRST)
OSC_IN: C7.1 U1.23(OSC_IN) Y1.1(OSC1)
OSC_OUT: C8.1 U1.24(OSC_OUT) Y1.2(OSC2)
RS485_RW: U1.113(PC12) ; sheet Designator/RS485_RW
RS485_RXD: U1.111(PC10) ; sheet Designator/RS485_RXD
RS485_TXD: U1.112(PC11) ; sheet Designator/RS485_TXD
RST_W5500: U1.44(PC4) ; port RST_W5500
SIM_RST: U1.68(PE15) ; port SIM_RST
SIM_STA: U1.67(PE14) ; port SIM_STA
SPI_CLK: U1.41(PA5) ; port SPI_CLK  [project net SPI1_CLK]
SPI_MISO: U1.42(PA6) ; port SPI_MISO  [project net SPI1_MISO]
SPI_MOSI: U1.43(PA7) ; port SPI_MOSI  [project net SPI1_MOSI]
SPI_NSS: U1.40(PA4) ; port SPI_NSS  [project net CS_W5500]
SWDCLK: P6.2 U1.109(PA14)
SWDIO: P6.3 U1.105(PA13)
TEMP1: U1.46(PB0) ; port TEMP1
TEMP2: U1.47(PB1) ; port TEMP2
UART1_RX: U1.101(PA9) ; sheet Designator/UART1_RX
UART1_TX: U1.102(PA10) ; sheet Designator/UART1_TX
UART2_RX: U1.36(PA2) ; port UART2_RX
UART2_TX: U1.37(PA3) ; port UART2_TX
UART3_RX: U1.69(PB10) ; port UART3_RX
UART3_TX: U1.70(PB11) ; port UART3_TX
NetR10_1: R10.1 U1.138(BOOT0)

Not connected (* = marked no-connect by the designer): U1 1(PE2) 2(PE3) 3(PE4) 4(PE5) 5(PE6) 7(PC13-TAMPER-RTC) 8(PC14-OSC32_IN) 9(PC15-OSC32_OUT) 10(PF0) 11(PF1) 12(PF2) 13(PF3) 14(PF4) 15(PF5) 18(PF6) 19(PF7) 20(PF8) 21(PF9) 22(PF10) 29(PC3) 34(PA0-WKUP) 49(PF11) 50(PF12) 53(PF13) 54(PF14) 55(PF15) 64(PE11) 65(PE12) 66(PE13) 97(PC7) 98(PC8) 99(PC9) 100(PA8) 103(PA11) 104(PA12) 106(NC) 110(PA15) 114(PD0) 115(PD1) 116(PD2) 117(PD3) 118(PD4) 119(PD5) 122(PD6) 123(PD7) 124(PG9) 125(PG10) 126(PG11) 127(PG12) 128(PG13) 129(PG14) 132(PG15) 133(PB3) 134(PB4) 139(PB8) 140(PB9) 141(PE0) 142(PE1)

### Notes on the sheet
- Title
- Size:
- Date:
- A4
- Number:
- Time:
- Revision:
- Sheet
- of
- File:

### Library data of the parts
C6 = 0805 100nF(104) 10% 50V: 贴片电容; ComponentLink1Description: 供应商链接; ComponentLink1URL: http://www.szlcsc.com/product/details_50686.html; Package: 0805; Supplier: LC; SuppliersPartNumber: C49678
C7 C8 = 0805 22pF (220) 5% 50V: 贴片电容; ComponentLink1Description: 供应商链接; ComponentLink1URL: http://www.szlcsc.com/product/details_2156.html; Package: 0805; Supplier: LC; SuppliersPartNumber: C1804
FB1 FB2 = 0805 100Ω 25% 100MHz: 贴片磁珠; ComponentLink1Description: 供应商链接; ComponentLink1URL: http://www.szlcsc.com/product/details_1367.html; Package: 0805; Supplier: LC; SuppliersPartNumber: C1015
key1 = 单刀开关
P6 = Header 5: Header, 5-Pin; LatestRevisionDate: 17-Jul-2002; LatestRevisionNote: Re-released for DXP Platform.; Publisher: Altium Limited
R9 R10 = 0805 10KΩ (1002) 1%: 贴片电阻; ComponentLink1Description: 供应商链接; ComponentLink1URL: http://www.szlcsc.com/product/details_18102.html; Package: 0805; Supplier: LC; SuppliersPartNumber: C17414
U1 = STM32F103ZET6: ARM; ComponentLink1Description: 供应商链接; ComponentLink1URL: http://www.szlcsc.com/product/details_8779.html; Package: LQFP-144_20x20x05P; Supplier: LC; SuppliersPartNumber: C8287
Y1 = SMD-5032_2P 8MHz 20ppm 20pF: 贴片晶振; ComponentLink1Description: 供应商链接; ComponentLink1URL: http://www.szlcsc.com/product/details_117214.html; Package: SMD-5032_2P; Supplier: LC; SuppliersPartNumber: C115962

## Sheet UART1.SchDoc
size A4
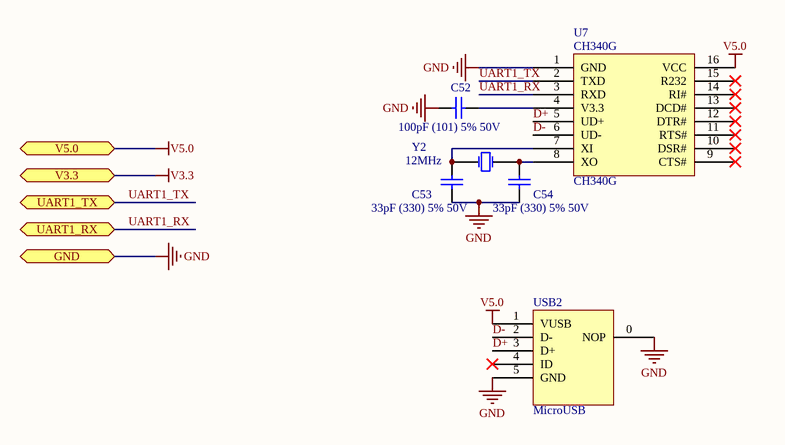
[diagram p9: UART1.SchDoc]

### Parts
C52  100pF (101) 5% 50V  [0805_C]
C53  33pF (330) 5% 50V  [0805_C]
C54  33pF (330) 5% 50V  [0805_C]
U7  CH340G  [SOIC-16_150mil]
USB2  MicroUSB  [MicroUSB]
Y2  12MHz  [Y]

### Ports
GND, UART1_RX, UART1_TX, V3.3, V5.0

### Nets
GND: C52.1 C53.2 C54.2 U7.1(GND) USB2.0(NOP) USB2.5(GND) ; port GND
V5.0: U7.16(VCC) USB2.1(VUSB) ; port V5.0
D+: U7.5(UD+) USB2.3(D+)
D-: U7.6(UD-) USB2.2(D-)
UART1_RX: U7.3(RXD) ; port UART1_RX
UART1_TX: U7.2(TXD) ; port UART1_TX
NetC52_2: C52.2 U7.4(V3.3)
NetC53_1: C53.1 U7.7(XI) Y2.1(OSC1)
NetC54_1: C54.1 U7.8(XO) Y2.2(OSC2)

Not connected (* = marked no-connect by the designer): U7 9(CTS#)* 10(DSR#)* 11(RTS#)* 12(DTR#)* 13(DCD#)* 14(RI#)* 15(R232)*; USB2 4(ID)*

### Library data of the parts
C52 = 0805 100pF (101) 5% 50V: 贴片电容; ComponentLink1Description: 供应商链接; ComponentLink1URL: http://www.szlcsc.com/product/details_2142.html; Package: 0805; Supplier: LC; SuppliersPartNumber: C1790
C53 C54 = 0805 33pF (330) 5% 50V: 贴片电容; ComponentLink1Description: 供应商链接; ComponentLink1URL: http://www.szlcsc.com/product/details_2166.html; Package: 0805; Supplier: LC; SuppliersPartNumber: C1814
U7 = CH340G_[C14267]: USB; ComponentLink1Description: 供应商链接; ComponentLink1URL: http://www.szlcsc.com/product/details_14927.html; Package: SOIC-16_150mil; Supplier: LC; SuppliersPartNumber: C14267
Y2 = SMD-5032_2P 8MHz 20ppm 20pF: 贴片晶振; ComponentLink1Description: 供应商链接; ComponentLink1URL: http://www.szlcsc.com/product/details_117214.html; Package: SMD-5032_2P; Supplier: LC; SuppliersPartNumber: C115962

## Sheet M24C02.SchDoc
size A4
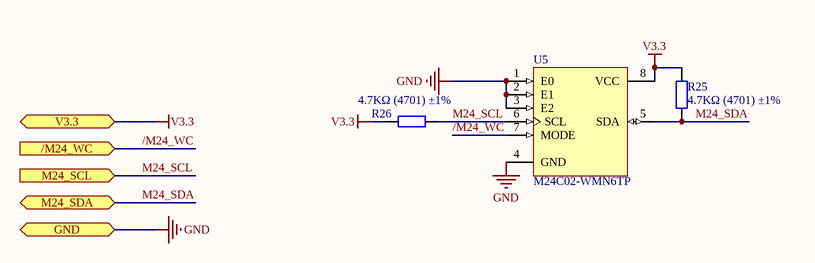
[diagram p10: M24C02.SchDoc]

### Parts
R25  4.7KΩ (4701) ±1%  [0805_R]
R26  4.7KΩ (4701) ±1%  [0805_R]
U5  M24C02-WMN6TP  [SOIC-8_150mil]

### Ports
/M24_WC (in), GND, M24_SCL (in), M24_SDA, V3.3

### Nets
GND: U5.1(E0) U5.2(E1) U5.3(E2) U5.4(GND) ; port GND
V3.3: R25.2 R26.2 U5.8(VCC) ; port V3.3
/M24_WC: U5.7(MODE) ; port /M24_WC
M24_SCL: R26.1 U5.6(SCL) ; port M24_SCL
M24_SDA: R25.1 U5.5(SDA) ; port M24_SDA

### Library data of the parts
R25 R26 = 0805 4.7KΩ (4701) 1%: 贴片电阻; ComponentLink1Description: 供应商链接; ComponentLink1URL: http://www.szlcsc.com/product/details_18361.html; Package: 0805; Supplier: LC; SuppliersPartNumber: C17673
U5 = M24C02-WMN6TP_[C7562]: EEPROM; ComponentLink1Description: 供应商链接; ComponentLink1URL: http://www.szlcsc.com/product/details_8039.html; Package: SOIC-8_150mil; Supplier: LC; SuppliersPartNumber: C7562

## Sheet RS485.SchDoc
size A4
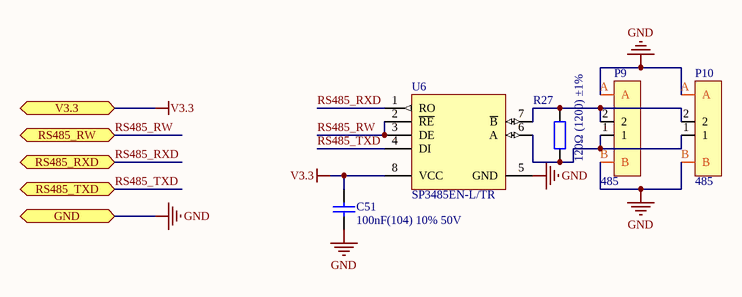
[diagram p11: RS485.SchDoc]

### Parts
C51  100nF(104) 10% 50V  [0805_C]
P9  485  [2P_XH2.54_W]
P10  485  [2P_XH2.54_W]
R27  120Ω (1200) ±1%  [0805_R]
U6  SP3485EN-L/TR  [SOIC-8_150mil]

### Ports
GND, RS485_RW, RS485_RXD, RS485_TXD, V3.3

### Nets
GND: C51.1 P9.A P9.B P10.A P10.B U6.5(GND) ; port GND
V3.3: C51.2 U6.8(VCC) ; port V3.3
RS485_RW: U6.2(~{RE}) U6.3(DE) ; port RS485_RW
RS485_RXD: U6.1(RO) ; port RS485_RXD
RS485_TXD: U6.4(DI) ; port RS485_TXD
NetP9_1: P9.1 P10.1 R27.1 U6.6(A)
NetP9_2: P9.2 P10.2 R27.2 U6.7(~{B})

### Library data of the parts
C51 = 0805 100nF(104) 10% 50V: 贴片电容; ComponentLink1Description: 供应商链接; ComponentLink1URL: http://www.szlcsc.com/product/details_50686.html; Package: 0805; Supplier: LC; SuppliersPartNumber: C49678
P9 P10 = 2P_XH2.54_W
R27 = 0805 120Ω (1200) 1%: 贴片电阻; ComponentLink1Description: 供应商链接; ComponentLink1URL: http://www.szlcsc.com/product/details_18125.html; Package: 0805; Supplier: LC; SuppliersPartNumber: C17437
U6 = SP3485EN-L/TR_[C8963]: RS-485/RS-422; ComponentLink1Description: 供应商链接; ComponentLink1URL: http://www.szlcsc.com/product/details_9482.html; Package: SOIC-8; Supplier: LC; SuppliersPartNumber: C8963

## Sheet POWER.SchDoc
size A4
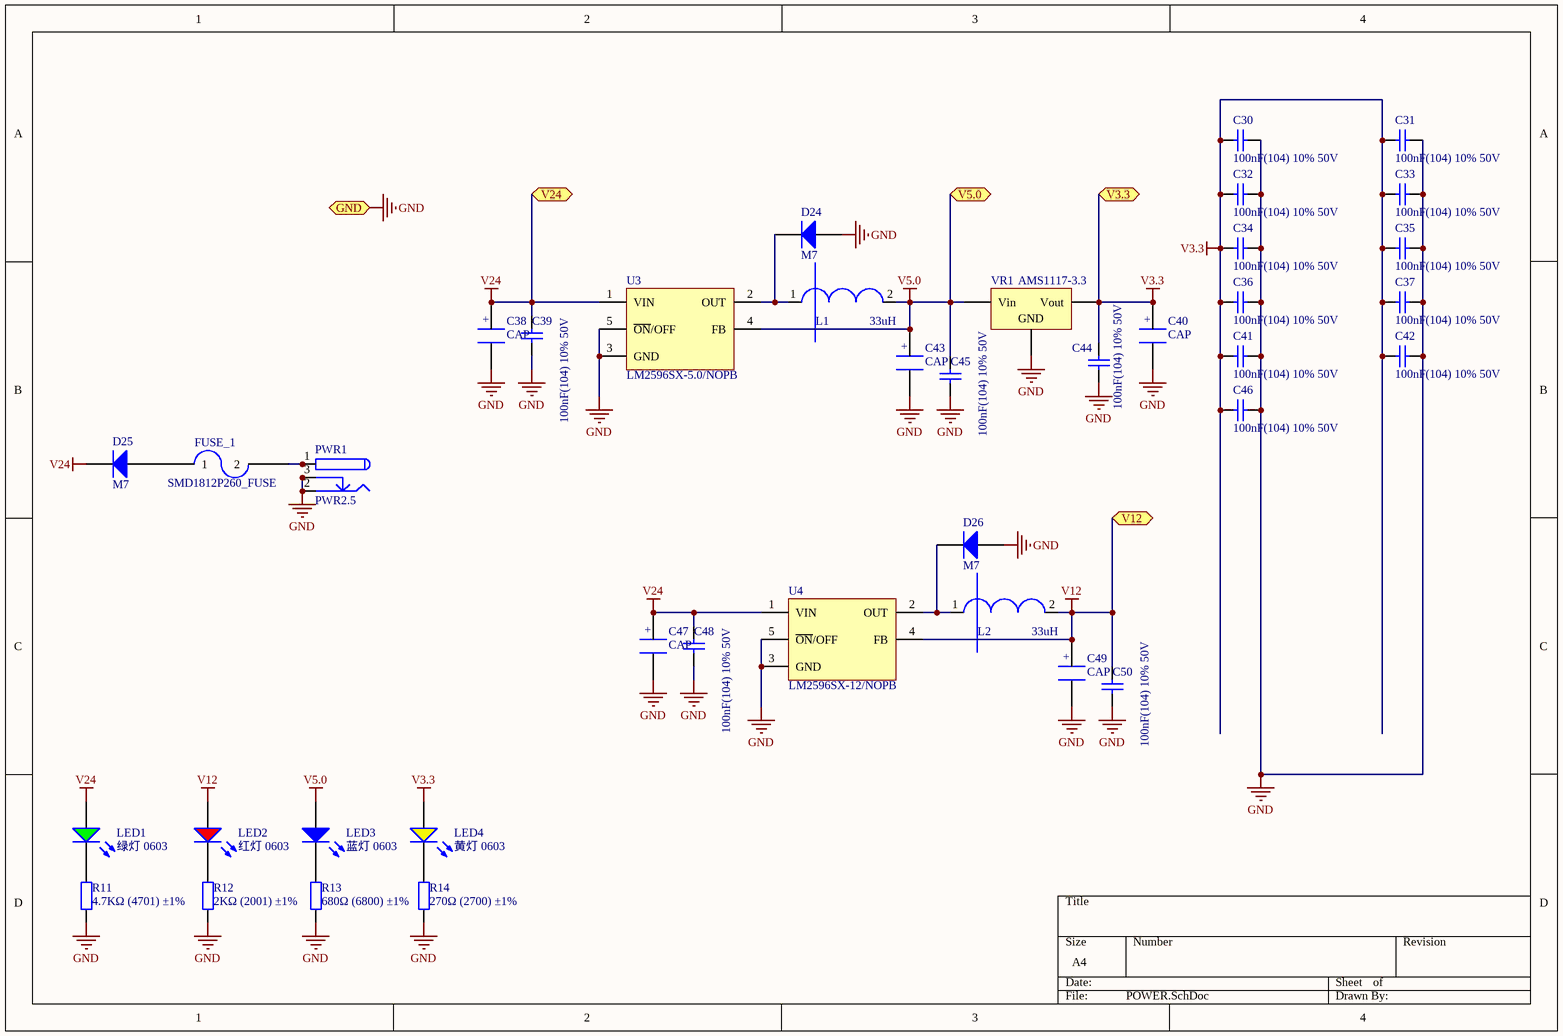
[diagram p12: POWER.SchDoc]

### Parts
C30  100nF(104) 10% 50V  [0805_C]
C31  100nF(104) 10% 50V  [0805_C]
C32  100nF(104) 10% 50V  [0805_C]
C33  100nF(104) 10% 50V  [0805_C]
C34  100nF(104) 10% 50V  [0805_C]
C35  100nF(104) 10% 50V  [0805_C]
C36  100nF(104) 10% 50V  [0805_C]
C37  100nF(104) 10% 50V  [0805_C]
C38  CAP  [8X12_CAP]
C39  100nF(104) 10% 50V  [0805_C]
C40  CAP  [8X12_CAP]
C41  100nF(104) 10% 50V  [0805_C]
C42  100nF(104) 10% 50V  [0805_C]
C43  CAP  [8X12_CAP]
C44  100nF(104) 10% 50V  [0805_C]
C45  100nF(104) 10% 50V  [0805_C]
C46  100nF(104) 10% 50V  [0805_C]
C47  CAP  [8X12_CAP]
C48  100nF(104) 10% 50V  [0805_C]
C49  CAP  [8X12_CAP]
C50  100nF(104) 10% 50V  [0805_C]
D24  M7  [SMA(DO-214AC)_S1]
D25  M7  [SMA(DO-214AC)_S1]
D26  M7  [SMA(DO-214AC)_S1]
FUSE_1  SMD1812P260_FUSE  [SMD1812P260]
L1  33uH  [L_127]
L2  33uH  [L_127]
LED1  绿灯 0603  [0603_LED_S1]
LED2  红灯 0603  [0603_LED_S1]
LED3  蓝灯 0603  [0603_LED_S1]
LED4  黄灯 0603  [0603_LED_S1]
PWR1  PWR2.5  [KLD-0202]
R11  4.7KΩ (4701) ±1%  [0805_R]
R12  2KΩ (2001) ±1%  [0805_R]
R13  680Ω (6800) ±1%  [0805_R]
R14  270Ω (2700) ±1%  [0805_R]
U3  LM2596SX-5.0/NOPB  [TO-263-5]
U4  LM2596SX-12/NOPB  [TO-263-5]
VR1  AMS1117-3.3  [SOT-223]

### Ports
GND, V3.3, V5.0, V12, V24

### Nets
GND: C30.1 C31.1 C32.1 C33.1 C34.1 C35.1 C36.1 C37.1 C38.2 C39.2 C40.2 C41.1 C42.1 C43.2 C44.2 C45.2 C46.1 C47.2 C48.2 C49.2 C50.2 D24.1(A) D26.1(A) PWR1.2 PWR1.2A PWR1.2B PWR1.3 PWR1.3A PWR1.3B R11.1 R12.1 R13.1 R14.1 U3.3(GND) U3.5(~{ON}/OFF) U4.3(GND) U4.5(~{ON}/OFF) VR1.1(GND) ; port GND
V3.3: C30.2 C31.2 C32.2 C33.2 C34.2 C35.2 C36.2 C37.2 C40.1 C41.2 C42.2 C44.1 C46.2 LED4.A VR1.2(Vout) ; port V3.3
V5.0: C43.1 C45.1 L1.2 LED3.A U3.4(FB) VR1.3(Vin) ; port V5.0
V12: C49.1 C50.1 L2.2 LED2.A U4.4(FB) ; port V12
V24: C38.1 C39.1 C47.1 C48.1 D25.2(K) LED1.A U3.1(VIN) U4.1(VIN) ; port V24
NetD24_2: D24.2(K) L1.1 U3.2(OUT)
NetD25_1: D25.1(A) FUSE_1.1
NetD26_2: D26.2(K) L2.1 U4.2(OUT)
NetFUSE_1_2: FUSE_1.2 PWR1.1 PWR1.1A PWR1.1B
NetLED1_K: LED1.K R11.2
NetLED2_K: LED2.K R12.2
NetLED3_K: LED3.K R13.2
NetLED4_K: LED4.K R14.2

### Notes on the sheet
- (in symbol CAP) +

### Library data of the parts
C30-C37 C39 C41 C42 C44-C46 C48 C50 = 0805 100nF(104) 10% 50V: 贴片电容; ComponentLink1Description: 供应商链接; ComponentLink1URL: http://www.szlcsc.com/product/details_50686.html; Package: 0805; Supplier: LC; SuppliersPartNumber: C49678
D24-D26 = SMA(DO-214AC) M7: as D4 on sheet motor; ComponentLink1Description: 供应商链接; ComponentLink1URL: http://www.szlcsc.com/product/details_2841.html; Package: SMA(DO-214AC); Supplier: LC; SuppliersPartNumber: C95872
LED1 = 0603 绿灯: 发光二极管; ComponentLink1Description: 供应商链接; ComponentLink1URL: http://www.szlcsc.com/product/details_73152.html; Package: 0603; Supplier: LC; SuppliersPartNumber: C72043
LED2 = 0603 红灯: 发光二极管; ComponentLink1Description: 供应商链接; ComponentLink1URL: http://www.szlcsc.com/product/details_2659.html; Package: 0603; Supplier: LC; SuppliersPartNumber: C2286
LED3 = 0603 蓝灯: 发光二极管; ComponentLink1Description: 供应商链接; ComponentLink1URL: http://www.szlcsc.com/product/details_73150.html; Package: 0603; Supplier: LC; SuppliersPartNumber: C72041
LED4 = 0603 黄灯: 发光二极管; ComponentLink1Description: 供应商链接; ComponentLink1URL: http://www.szlcsc.com/product/details_73147.html; Package: 0603; Supplier: LC; SuppliersPartNumber: C72038
PWR1 = PWR2.5: Low Voltage Power Supply Connector; Published: 17-Dec-2003; DatasheetDocument: 09-May-2002; Publisher: Altium Limited; ComponentLink1Description: Manufacturer Link; ComponentLink1URL: http://domino.kycon.com/internet/Products.html
R11 = 0805 4.7KΩ (4701) 1%: 贴片电阻; ComponentLink1Description: 供应商链接; ComponentLink1URL: http://www.szlcsc.com/product/details_18361.html; Package: 0805; Supplier: LC; SuppliersPartNumber: C17673
R12 = 0805 2KΩ (2001) 1%: 贴片电阻; ComponentLink1Description: 供应商链接; ComponentLink1URL: http://www.szlcsc.com/product/details_18292.html; Package: 0805; Supplier: LC; SuppliersPartNumber: C17604
R13 = 0805 680Ω (6800) 1%: 贴片电阻; ComponentLink1Description: 供应商链接; ComponentLink1URL: http://www.szlcsc.com/product/details_18486.html; Package: 0805; Supplier: LC; SuppliersPartNumber: C17798
R14 = 0805 270Ω (2700) 1%: 贴片电阻; ComponentLink1Description: 供应商链接; ComponentLink1URL: http://www.szlcsc.com/product/details_18278.html; Package: 0805; Supplier: LC; SuppliersPartNumber: C17590
U3 U4 = LM2596SX-5.0/NOPB_[C10002]: DC-DC芯片; ComponentLink1Description: 供应商链接; ComponentLink1URL: http://www.szlcsc.com/product/details_10538.html; Package: TO-263-5; Supplier: LC; SuppliersPartNumber: C10002
VR1 = SOT-223 AMS1117-3.3: 低压差线性稳压(LDO); ComponentLink1Description: 供应商链接; ComponentLink1URL: http://www.szlcsc.com/product/details_6652.html; Package: SOT-223; Supplier: LC; SuppliersPartNumber: C6186

## Sheet Sound.SchDoc
size A4
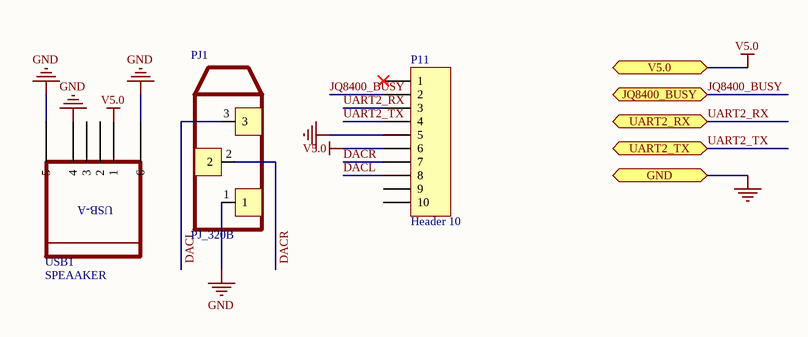
[diagram p13: Sound.SchDoc]

### Parts
P11  Header 10  [HDR1X10]
PJ1  PJ_320B  [PJ-320B]
USB1  SPEAAKER  [USB-A]

### Ports
GND, JQ8400_BUSY, UART2_RX, UART2_TX, V5.0

### Nets
GND: P11.5 PJ1.1 USB1.4 USB1.5 USB1.6 ; port GND
V5.0: P11.6 USB1.1 ; port V5.0
DACL: P11.8 PJ1.3
DACR: P11.7 PJ1.2
JQ8400_BUSY: P11.2 ; port JQ8400_BUSY
UART2_RX: P11.3 ; port UART2_RX
UART2_TX: P11.4 ; port UART2_TX

Not connected (* = marked no-connect by the designer): P11 1* 9 10; USB1 2 3

### Library data of the parts
P11 = Header 10: Header, 10-Pin; LatestRevisionDate: 17-Jul-2002; LatestRevisionNote: Re-released for DXP Platform.; Publisher: Altium Limited
USB1 = USB-A

## Sheet LCD12864.SchDoc
size A4
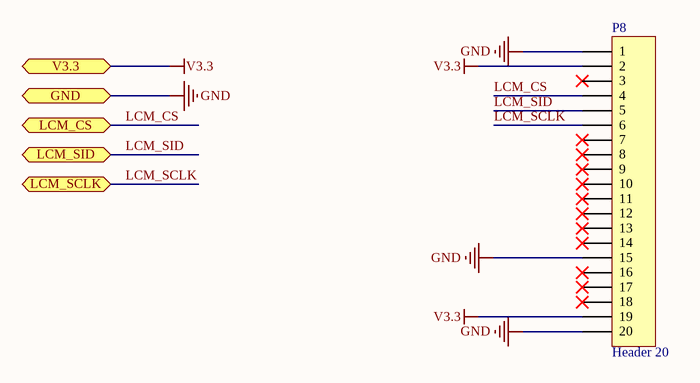
[diagram p14: LCD12864.SchDoc]

### Parts
P8  Header 20  [HDR1X20]

### Ports
GND, LCM_CS, LCM_SCLK, LCM_SID, V3.3

### Nets
GND: P8.1 P8.15 P8.20 ; port GND
V3.3: P8.2 P8.19 ; port V3.3
LCM_CS: P8.4 ; port LCM_CS
LCM_SCLK: P8.6 ; port LCM_SCLK
LCM_SID: P8.5 ; port LCM_SID

Not connected (* = marked no-connect by the designer): P8 3* 7* 8* 9* 10* 11* 12* 13* 14* 16* 17* 18*

### Library data of the parts
P8 = Header 20: Header, 20-Pin; LatestRevisionDate: 17-Jul-2002; LatestRevisionNote: Re-released for DXP Platform.; Publisher: Altium Limited

## Sheet DOOR.SchDoc
size A4
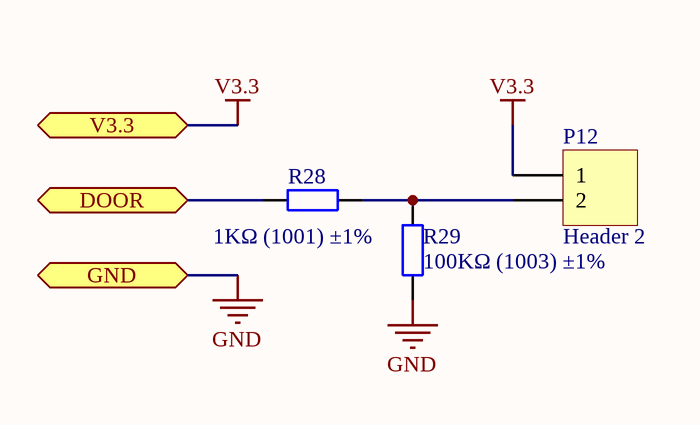
[diagram p15: DOOR.SchDoc]

### Parts
P12  Header 2  [2P_XH2.54]
R28  1KΩ (1001) ±1%  [0805_R]
R29  100KΩ (1003) ±1%  [0805_R]

### Ports
DOOR, GND, V3.3

### Nets
GND: R29.2 ; port GND
V3.3: P12.1 ; port V3.3
DOOR: R28.1 ; port DOOR
NetP12_2: P12.2 R28.2 R29.1

### Library data of the parts
P12 = Header 2: Header, 2-Pin; LatestRevisionDate: 17-Jul-2002; LatestRevisionNote: Re-released for DXP Platform.; Publisher: Altium Limited
R28 = 0805 1KΩ (1001) 1%: 贴片电阻; ComponentLink1Description: 供应商链接; ComponentLink1URL: http://www.szlcsc.com/product/details_18201.html; Package: 0805; Supplier: LC; SuppliersPartNumber: C17513
R29 = 0805 100KΩ (1003) 1%: 贴片电阻; ComponentLink1Description: 供应商链接; ComponentLink1URL: http://www.szlcsc.com/product/details_18095.html; Package: 0805; Supplier: LC; SuppliersPartNumber: C17407

## Nets that join several sheets
GND: NET (C29.2 P7.4 U2.11 U2.12), Designator/C1 (Q5_C1.2 Q6_C1.2 R19_C1.1 R20_C1.2), Designator/C2 (Q5_C2.2 Q6_C2.2 R19_C2.1 R20_C2.2), Designator/C3 (Q5_C3.2 Q6_C3.2 R19_C3.1 R20_C3.2), Designator/C4 (Q5_C4.2 Q6_C4.2 R19_C4.1 R20_C4.2), Designator/C5 (Q5_C5.2 Q6_C5.2 R19_C5.1 R20_C5.2), Designator/C6 (Q5_C6.2 Q6_C6.2 R19_C6.1 R20_C6.2), Designator/C7 (Q5_C7.2 Q6_C7.2 R19_C7.1 R20_C7.2), Designator/C8 (Q5_C8.2 Q6_C8.2 R19_C8.1 R20_C8.2), Designator/C9 (Q5_C9.2 Q6_C9.2 R19_C9.1 R20_C9.2), Designator/C10 (Q5_C10.2 Q6_C10.2 R19_C10.1 R20_C10.2), Designator/R1 (Q8_R1.2 R24_R1.2), Designator/R2 (Q8_R2.2 R24_R2.2), Designator/R3 (Q8_R3.2 R24_R3.2), Designator/R4 (Q8_R4.2 R24_R4.2), Designator/R5 (Q8_R5.2 R24_R5.2), Designator/R6 (Q8_R6.2 R24_R6.2), Designator/R7 (Q8_R7.2 R24_R7.2), Designator/R8 (Q8_R8.2 R24_R8.2), Designator/R9 (Q8_R9.2 R24_R9.2), Designator/R10 (Q8_R10.2 R24_R10.2), Air conditioning (R1.2 R2.2), Designator/C11 (Q5_C11.2 Q6_C11.2 R19_C11.1 R20_C11.2), Designator/C12 (Q5_C12.2 Q6_C12.2 R19_C12.1 R20_C12.2), Designator/C13 (Q5_C13.2 Q6_C13.2 R19_C13.1 R20_C13.2), DROP (P3.2 P3.4 P4.2), LED (Q2.2 Q3.2 R7.1 R8.2), MCU (19 pins), UART1 (6 pins), M24C02 (U5.1 U5.2 U5.3 U5.4), RS485 (6 pins), POWER (38 pins), Sound (5 pins), LCD12864 (P8.1 P8.15 P8.20), DOOR (R29.2)
V3.3: NET (P7.1), Air conditioning (C3.1 C5.1 P2.2 P2.4), MCU (16 pins), M24C02 (R25.2 R26.2 U5.8), RS485 (C51.2 U6.8), POWER (15 pins), LCD12864 (P8.2 P8.19), DOOR (P12.1)
V5.0: NET (P7.2), UART1 (U7.16 USB2.1), POWER (6 pins), Sound (P11.6 USB1.1)
V12: NET (C29.1 U2.13 U2.14), POWER (5 pins)
V24: Designator/C1 (Q4_C1.2 R15_C1.2), Designator/C2 (Q4_C2.2 R15_C2.2), Designator/C3 (Q4_C3.2 R15_C3.2), Designator/C4 (Q4_C4.2 R15_C4.2), Designator/C5 (Q4_C5.2 R15_C5.2), Designator/C6 (Q4_C6.2 R15_C6.2), Designator/C7 (Q4_C7.2 R15_C7.2), Designator/C8 (Q4_C8.2 R15_C8.2), Designator/C9 (Q4_C9.2 R15_C9.2), Designator/C10 (Q4_C10.2 R15_C10.2), Designator/R1 (Q7_R1.2 R21_R1.1), Designator/R2 (Q7_R2.2 R21_R2.1), Designator/R3 (Q7_R3.2 R21_R3.1), Designator/R4 (Q7_R4.2 R21_R4.1), Designator/R5 (Q7_R5.2 R21_R5.1), Designator/R6 (Q7_R6.2 R21_R6.1), Designator/R7 (Q7_R7.2 R21_R7.1), Designator/R8 (Q7_R8.2 R21_R8.1), Designator/R9 (Q7_R9.2 R21_R9.1), Designator/R10 (Q7_R10.2 R21_R10.1), Air conditioning (7 pins), Designator/C11 (Q4_C11.2 R15_C11.2), Designator/C12 (Q4_C12.2 R15_C12.2), Designator/C13 (Q4_C13.2 R15_C13.2), DROP (P4.1), LED (P5.1 Q1.2 R3.2), POWER (8 pins)
/M24_WC: MCU (U1.135), M24C02 (U5.7)
column1: Designator/C1 (R17_C1.2), MCU (U1.82)
column2: Designator/C2 (R17_C2.2), MCU (U1.81)
column3: Designator/C3 (R17_C3.2), MCU (U1.80)
column4: Designator/C4 (R17_C4.2), MCU (U1.79)
column5: Designator/C5 (R17_C5.2), MCU (U1.78)
column6: Designator/C6 (R17_C6.2), MCU (U1.77)
column7: Designator/C7 (R17_C7.2), MCU (U1.76)
column8: Designator/C8 (R17_C8.2), MCU (U1.75)
column9: Designator/C9 (R17_C9.2), MCU (U1.74)
column10: Designator/C10 (R17_C10.2), MCU (U1.73)
COLUMN11: Designator/C11 (R17_C11.2), MCU (U1.28)
COLUMN12: Designator/C12 (R17_C12.2), MCU (U1.27)
COLUMN13: Designator/C13 (R17_C13.2), MCU (U1.26)
CS_W5500: NET (P7.7), MCU (U1.40)
DOOR: MCU (U1.48), DOOR (R28.1)
DROP_EN: DROP (P3.1), MCU (U1.60)
DROP_OUT: DROP (P3.3), MCU (U1.59)
INT_W5500: NET (P7.8), MCU (U1.45)
JQ8400_BUSY: MCU (U1.35), Sound (P11.2)
LCM_CS: MCU (U1.56), LCD12864 (P8.4)
LCM_SCLK: MCU (U1.58), LCD12864 (P8.6)
LCM_SID: MCU (U1.57), LCD12864 (P8.5)
LED: LED (R5.2), MCU (U1.63)
M24_SCL: MCU (U1.136), M24C02 (R26.1 U5.6)
M24_SDA: MCU (U1.137), M24C02 (R25.1 U5.5)
N_R1: Designator/R1 (R23_R1.2), MCU (U1.85)
N_R2: Designator/R2 (R23_R2.2), MCU (U1.86)
N_R3: Designator/R3 (R23_R3.2), MCU (U1.87)
N_R4: Designator/R4 (R23_R4.2), MCU (U1.88)
N_R5: Designator/R5 (R23_R5.2), MCU (U1.89)
N_R6: Designator/R6 (R23_R6.2), MCU (U1.90)
N_R7: Designator/R7 (R23_R7.2), MCU (U1.91)
N_R8: Designator/R8 (R23_R8.2), MCU (U1.92)
N_R9: Designator/R9 (R23_R9.2), MCU (U1.93)
N_R10: Designator/R10 (R23_R10.2), MCU (U1.96)
PULL1: motor (C9.1 D5.1 Matrix1.11), Designator/C1 (Q6_C1.3)
PULL2: motor (C11.1 D7.1 Matrix1.12), Designator/C2 (Q6_C2.3)
PULL3: motor (C13.1 D9.1 Matrix1.13), Designator/C3 (Q6_C3.3)
PULL4: motor (C15.1 D11.1 Matrix1.14), Designator/C4 (Q6_C4.3)
PULL5: motor (C17.1 D13.1 Matrix1.15), Designator/C5 (Q6_C5.3)
PULL6: motor (C19.1 D15.1 Matrix1.16), Designator/C6 (Q6_C6.3)
PULL7: motor (C21.1 D17.1 Matrix1.17), Designator/C7 (Q6_C7.3)
PULL8: motor (C23.1 D19.1 Matrix1.18), Designator/C8 (Q6_C8.3)
PULL9: motor (C25.1 D21.1 Matrix1.19), Designator/C9 (Q6_C9.3)
PULL10: motor (C27.1 D23.1 Matrix1.20), Designator/C10 (Q6_C10.3)
PULL11: Air conditioning (C1.1 D1.1 P1.3), Designator/C11 (Q6_C11.3)
PULL12: Air conditioning (C2.1 D2.1 P1.2), Designator/C12 (Q6_C12.3)
PULL13: Air conditioning (C4.1 D3.1 P1.1), Designator/C13 (Q6_C13.3)
PUSH1: motor (C10.2 D4.2 Matrix1.1), Designator/R1 (Q7_R1.3)
PUSH2: motor (C12.2 D6.2 Matrix1.2), Designator/R2 (Q7_R2.3)
PUSH3: motor (C14.2 D8.2 Matrix1.3), Designator/R3 (Q7_R3.3)
PUSH4: motor (C16.2 D10.2 Matrix1.4), Designator/R4 (Q7_R4.3)
PUSH5: motor (C18.2 D12.2 Matrix1.5), Designator/R5 (Q7_R5.3)
PUSH6: motor (C20.2 D14.2 Matrix1.6), Designator/R6 (Q7_R6.3)
PUSH7: motor (C22.2 D16.2 Matrix1.7), Designator/R7 (Q7_R7.3)
PUSH8: motor (C24.2 D18.2 Matrix1.8), Designator/R8 (Q7_R8.3)
PUSH9: motor (C26.2 D20.2 Matrix1.9), Designator/R9 (Q7_R9.3)
PUSH10: motor (C28.2 D22.2 Matrix1.10), Designator/R10 (Q7_R10.3)
RS485_RW: MCU (U1.113), RS485 (U6.2 U6.3)
RS485_RXD: MCU (U1.111), RS485 (U6.1)
RS485_TXD: MCU (U1.112), RS485 (U6.4)
RST_W5500: NET (P7.6), MCU (U1.44)
SIM_RST: NET (U2.10), MCU (U1.68)
SIM_STA: NET (U2.5), MCU (U1.67)
SPI1_CLK: NET (P7.9), MCU (U1.41)
SPI1_MISO: NET (P7.3), MCU (U1.42)
SPI1_MOSI: NET (P7.5), MCU (U1.43)
TEMP1: Air conditioning (C3.2 P2.3 R1.1), MCU (U1.46)
TEMP2: Air conditioning (C5.2 P2.1 R2.1), MCU (U1.47)
UART1_RX: MCU (U1.101), UART1 (U7.3)
UART1_TX: MCU (U1.102), UART1 (U7.2)
UART2_RX: MCU (U1.36), Sound (P11.3)
UART2_TX: MCU (U1.37), Sound (P11.4)
UART3_RX: NET (U2.7), MCU (U1.69)
UART3_TX: NET (U2.6), MCU (U1.70)